# EAGLE design nano_bt_hor (EAGLE 9.5.0)
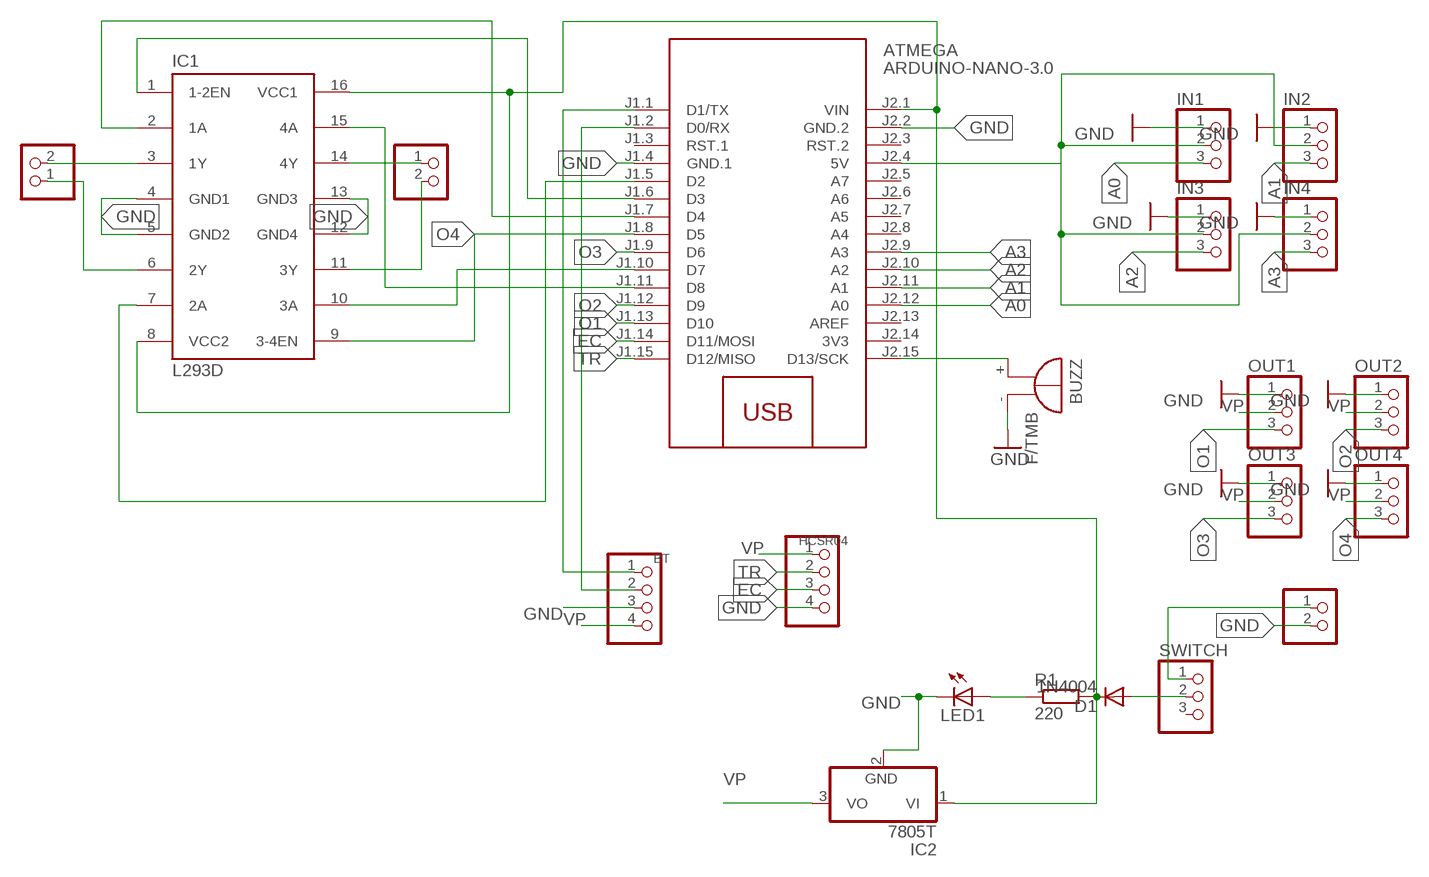
[diagram p0: schematic, sheet 1]

## Parts
ATMEGA  ARDUINO-NANO-3.0  [ARDUINO-NANO-3.0]
BT  PINHD-1X4  [1X04]
BUZZ  F/TMB  [F/TMB]
D1  1N4004  [DO41-10]
DCV  PINHD-1X2  [1X02]
HCSR04  PINHD-1X4  [1X04]
IC1  L293D  [DIL16]
IC2  7805T  [TO220H]
IN1  PINHD-1X3  [1X03]
IN2  PINHD-1X3  [1X03]
IN3  PINHD-1X3  [1X03]
IN4  PINHD-1X3  [1X03]
LED1  LED3MM  [LED3MM]
MT1  PINHD-1X2  [1X02]
MT2  PINHD-1X2  [1X02]
OUT1  PINHD-1X3  [1X03]
OUT2  PINHD-1X3  [1X03]
OUT3  PINHD-1X3  [1X03]
OUT4  PINHD-1X3  [1X03]
R1  220  R-EU_0204/7  [0204/7]
SWITCH  PINHD-1X3  [1X03]

## Nets
A0: ATMEGA.J2.12(A0) IN1.3
A1: ATMEGA.J2.11(A1) IN2.3
A2: ATMEGA.J2.10(A2) IN3.3
A3: ATMEGA.J2.9(A3) IN4.3
EC: ATMEGA.J1.14(D11/MOSI) HCSR04.3
GND: ATMEGA.J1.4(GND.1) ATMEGA.J2.2(GND.2) BT.3 BUZZ.- DCV.2 HCSR04.4 IC1.4(GND1) IC1.5(GND2) IC1.12(GND4) IC1.13(GND3) IC2.2(GND) IN1.1 IN2.1 IN3.1 IN4.1 LED1.K(C) OUT1.1 OUT2.1 OUT3.1 OUT4.1
N$1: IC1.3(1Y) MT1.2
N$2: IC1.6(2Y) MT1.1
N$3: IC1.14(4Y) MT2.1
N$4: IC1.11(3Y) MT2.2
N$5: ATMEGA.J1.1(D1/TX) BT.1
N$6: ATMEGA.J1.2(D0/RX) BT.2
N$7: ATMEGA.J2.15(D13/SCK) BUZZ.+
N$8: ATMEGA.J2.1(VIN) D1.C IC1.8(VCC2) IC1.16(VCC1) IC2.1(VI) R1.2
N$9: ATMEGA.J1.5(D2) IC1.7(2A)
N$10: ATMEGA.J1.6(D3) IC1.1(1-2EN)
N$11: ATMEGA.J1.7(D4) IC1.2(1A)
N$12: DCV.1 SWITCH.1
N$13: ATMEGA.J1.10(D7) IC1.10(3A)
N$14: ATMEGA.J1.11(D8) IC1.15(4A)
N$15: D1.A SWITCH.2
N$16: LED1.A R1.1
N$22: ATMEGA.J2.4(5V) IN1.2 IN2.2 IN3.2 IN4.2
O1: ATMEGA.J1.13(D10) OUT1.3
O2: ATMEGA.J1.12(D9) OUT2.3
O3: ATMEGA.J1.9(D6) OUT3.3
O4: ATMEGA.J1.8(D5) IC1.9(3-4EN) OUT4.3
TR: ATMEGA.J1.15(D12/MISO) HCSR04.2
VP: BT.4 HCSR04.1 IC2.3(VO) OUT1.2 OUT2.2 OUT3.2 OUT4.2
Unconnected: ATMEGA.J1.3(RST.1) ATMEGA.J2.3(RST.2) ATMEGA.J2.5(A7) ATMEGA.J2.6(A6) ATMEGA.J2.7(A5) ATMEGA.J2.8(A4) ATMEGA.J2.13(AREF) SWITCH.3

## Power pins joined to a net without a drawn wire
3V3: ATMEGA.J2.14(3V3)

## Library data of the parts
ATMEGA = diy-modules:ARDUINO-NANO-3.0: Arduino Nano 3.0 and compatible devices More details available here: https://www.arduino.cc/en/Main/ArduinoBoardNano Click here to find device on ebay.com <http://www.ebay.com/sch/arduino+nano>
BT HCSR04 = pinhead:PINHD-1X4: PIN HEADER
BUZZ = buzzer:F/TMB: BUZZER Source: Buerklin; OC_FARNELL: unknown; OC_NEWARK: unknown
D1 = adafruit_arduino:1N4004: DIODE General purpose 1N400x type rectifier (With bigger pads) http://www.ladyada.net/library/pcb/eaglelibrary.html
DCV MT1 MT2 = pinhead:PINHD-1X2: PIN HEADER
IC1 = st-microelectronics:L293D: PUSH-PULL 4 CHANNEL DRIVER; MPN: L293D; OC_FARNELL: 9589619; OC_NEWARK: 56P8249
IC2 = adafruit_arduino:78*: Positive VOLTAGE REGULATOR Added bigger pads to the TO-92 package
IN1-IN4 OUT1-OUT4 = adafruit:PINHD-1X3: PIN HEADER
LED1 = adafruit_arduino:LED: LED OSRAM: - CHIPLED LG R971, LG N971, LY N971, LG Q971, LY Q971, LO R971, LY R971 LH N974, LH R974 LS Q976, LO Q976, LY Q976 LO Q996 - Hyper CHIPLED LW Q18S LB Q993, LB Q99A, LB R99A - SideLED LS A670, LO A670, LY A670, LG A670, LP A670 LB A673, LV A673, LT A673, LW A673 LH A674 LY A675 LS A676, LA A676, LO A676, LY A676, LW A676 LS A679, LY A679, LG A679 - Hyper Micro SIDELED® LS Y876, LA Y876, LO Y876, LY Y876 LT Y87S - SmartLED LW L88C, LW L88S LB L89C, LB L89S, LG L890 LS L89K, LO L89K, LY L89K LS L896, LA L896, LO L896, LY L896 - TOPLED LS T670, LO T670, LY T670, LG T670, LP T670 LSG T670, LSP T670, LSY T670, LOP T670, LYG T670 LG T671, LOG T671, LSG T671 LB T673, LV T673, LT T673, LW T673 LH T674 LS T676, LA T676, LO T676, LY T676, LB T676, LH T676, LSB T676, LW T676 LB T67C, LV T67C, LT T67C, LS T67K, LO T67K, LY T67K, LW E67C LS E67B, LA E67B, LO E67B, LY E67B, LB E67C, LV E67C, LT E67C LW T67C LS T679, LY T679, LG T679 LS T770, LO T770, LY T770, LG T770, LP T770 LB T773, LV T773, LT T773, LW T773 LH T774 LS E675, LA E675, LY E675, LS T675 LS T776, LA T776, LO T776, LY T776, LB T776 LHGB T686 LT T68C, LB T68C - Hyper Mini TOPLED® LB M676 - Mini TOPLED Santana® LG M470 LS M47K, LO M47K, LY M47K Source: http://www.osram.convergy.de/
R1 = rcl:R-EU_: RESISTOR, European symbol; SPICEPREFIX: R
SWITCH = adafruit_arduino:PINHD-1X3: PIN HEADER

## Board
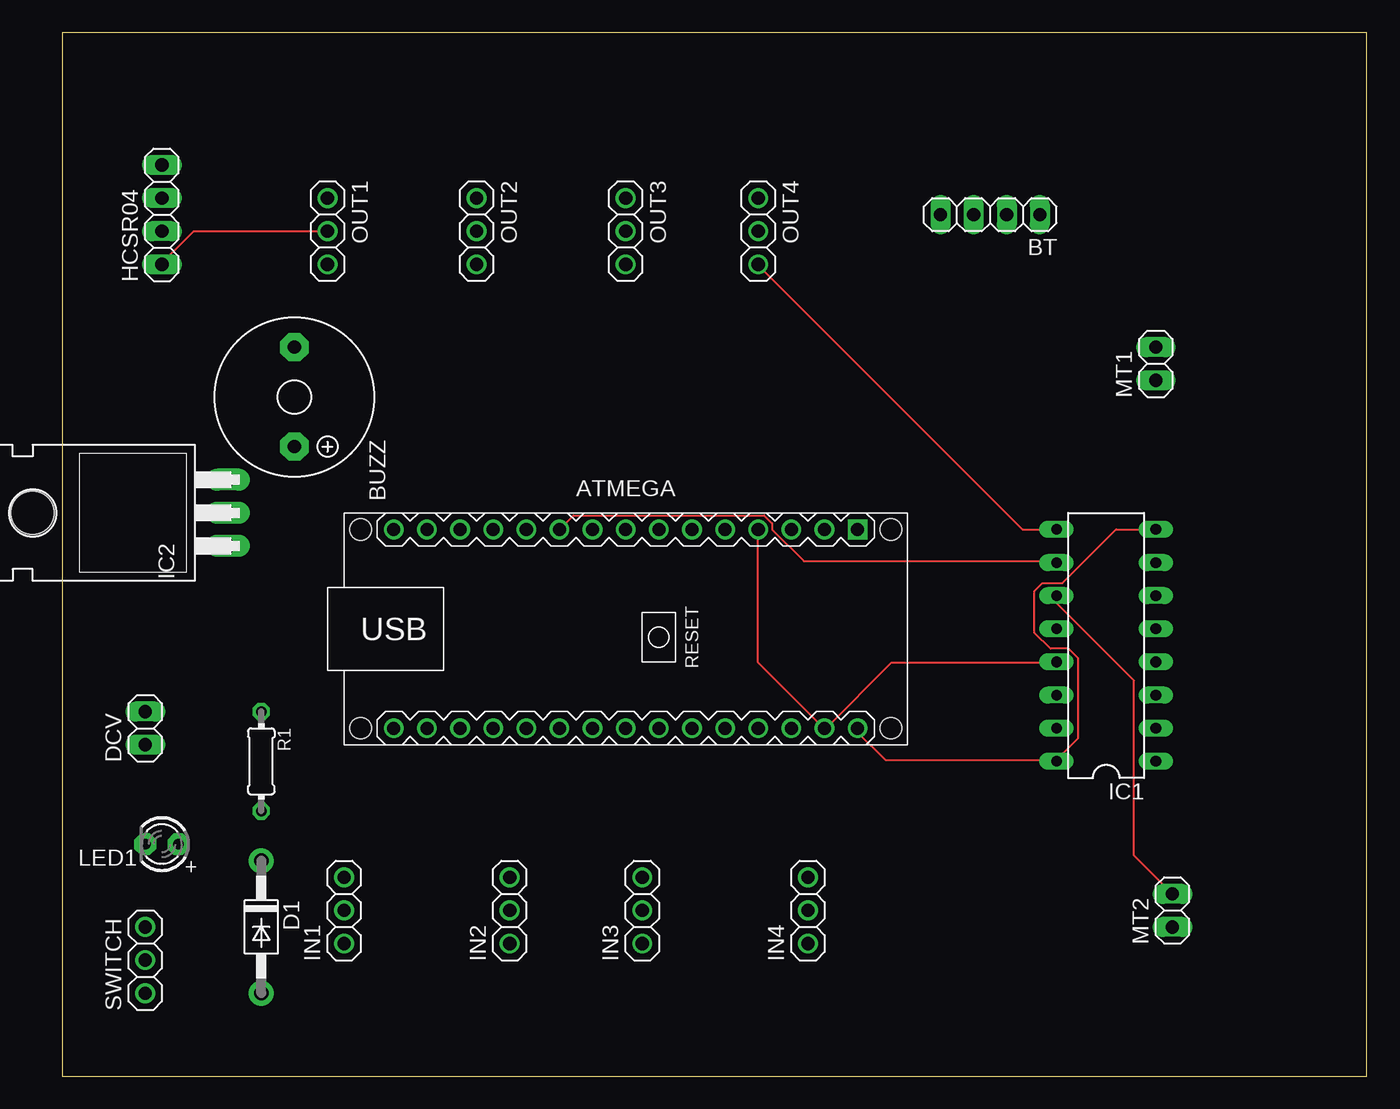
[diagram p1: board, top side]
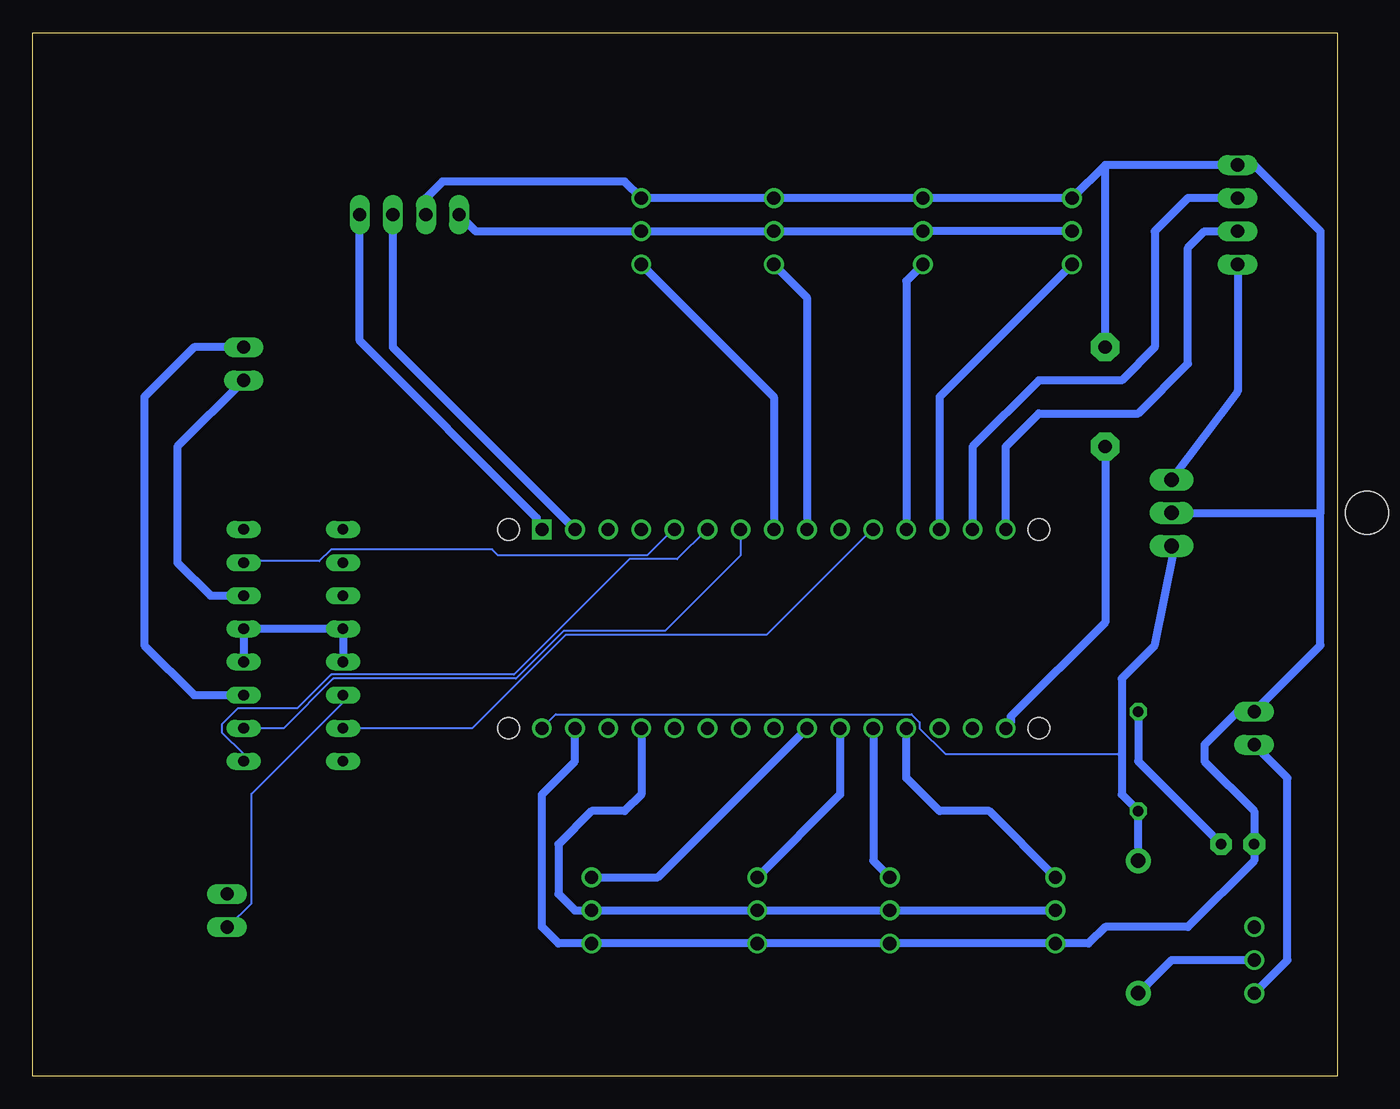
[diagram p2: board, bottom side, seen from below]

Size 100 x 80 mm. Coordinates in mm from the lower left corner, seen from the top.
Outline: 0,0 100,0 100,80 0,80 0,0
Copper layers (1*16): Top 0.035mm / dielectric 1.5mm / Bottom 0.035mm
Design rules "default": minimum track width 6mil, minimum drill 0.35mm, track to track 6mil, track to pad 6mil, pad to pad 6mil, via to via 6mil, smd to smd 6mil, copper to edge 40mil, drill to drill 6mil, minimum pad ring 10mil, minimum via ring 8mil, stop-mask expansion 4mil, vias tented up to drill 0mil, thermal gap 10mil

### Footprints (pad centres in the part's own frame; a part is rotated, then mirrored left to right if it is on the bottom)
ARDUINO-NANO-3.0 = drill 1 square: J1.1 17.78,7.62 | drill 1: J1.2 15.24,7.62; J1.3 12.7,7.62; J1.4 10.16,7.62; J1.5 7.62,7.62; J1.6 5.08,7.62; J1.7 2.54,7.62; J1.8 0,7.62; J1.9 -2.54,7.62; J1.10 -5.08,7.62; J1.11 -7.62,7.62; J1.12 -10.16,7.62; J1.13 -12.7,7.62; J1.14 -15.24,7.62; J1.15 -17.78,7.62; J2.1 17.78,-7.62; J2.2 15.24,-7.62; J2.3 12.7,-7.62; J2.4 10.16,-7.62; J2.5 7.62,-7.62; J2.6 5.08,-7.62; J2.7 2.54,-7.62; J2.8 0,-7.62; J2.9 -2.54,-7.62; J2.10 -5.08,-7.62; J2.11 -7.62,-7.62; J2.12 -10.16,-7.62; J2.13 -12.7,-7.62; J2.14 -15.24,-7.62; J2.15 -17.78,-7.62 | hole 1.651: -20.32,7.62; -20.32,-7.62; 20.32,-7.62; 20.32,7.62
1X04 = drill 1.016 long: 1 -3.81,0; 2 -1.27,0; 3 1.27,0; 4 3.81,0
F/TMB = drill 1.016 pad 2.159 octagon: + 3.81,0; - -3.81,0
DO41-10 = drill 1.118 pad 1.93: A 5.08,0; C -5.08,0
1X02 = drill 1.016 long: 1 -1.27,0; 2 1.27,0
DIL16 = drill 0.813 long: 1 -8.89,-3.81; 2 -6.35,-3.81; 3 -3.81,-3.81; 4 -1.27,-3.81; 5 1.27,-3.81; 6 3.81,-3.81; 7 6.35,-3.81; 8 8.89,-3.81; 9 8.89,3.81; 10 6.35,3.81; 11 3.81,3.81; 12 1.27,3.81; 13 -1.27,3.81; 14 -3.81,3.81; 15 -6.35,3.81; 16 -8.89,3.81
TO220H = drill 1.118 long: 1 -2.54,-10.16; 2 0,-10.16; 3 2.54,-10.16 | hole 3.302: 0,4.826
1X03 = drill 1.016: 1 -2.54,0; 2 0,0; 3 2.54,0
LED3MM = drill 0.813 pad 1.676 octagon: A -1.27,0; K 1.27,0
0204/7 = drill 0.813 octagon: 1 -3.81,0; 2 3.81,0

### Placement (x,y rotation side)
ATMEGA  43.18,34.29 0 top
BT  71.12,66.04 180 top
BUZZ  17.78,52.07 270 top
D1  15.24,11.43 270 top
DCV  6.35,26.67 90 top
HCSR04  7.62,66.04 90 top
IC1  80.01,33.02 90 top
IC2  2.54,43.18 90 top
IN1  21.59,12.7 90 top
IN2  34.29,12.7 90 top
IN3  44.45,12.7 90 top
IN4  57.15,12.7 90 top
LED1  7.62,17.78 180 top
MT1  83.82,54.61 90 top
MT2  85.09,12.7 90 top
OUT1  20.32,64.77 270 top
OUT2  31.75,64.77 270 top
OUT3  43.18,64.77 270 top
OUT4  53.34,64.77 270 top
R1  15.24,24.13 270 top
SWITCH  6.35,8.89 90 top

### Tracks (layer width: path | path; a pad name or v marks a point on that pad's centre or on a via)
A0
  Bottom 0.61: IN1.3 26.67,20.32 30.48,20.32 33.02,22.86 ATMEGA.J2.12
A1
  Bottom 0.61: ATMEGA.J2.11 35.56,16.51 IN2.3
A2
  Bottom 0.61: ATMEGA.J2.10 38.1,21.59 IN3.3
A3
  Bottom 0.61: IN4.3 52.07,15.24 ATMEGA.J2.9
EC
  Bottom 0.61: HCSR04.3 11.43,67.31 13.97,64.77 13.97,55.88 16.51,53.34 22.86,53.34 27.94,48.26 ATMEGA.J1.14
GND
  Top 0.152: ATMEGA.J1.4 53.34,31.7 58.37,26.67 ATMEGA.J2.2 58.52,26.67 63.55,31.7 76.2,31.7 IC1.13
  Bottom 0.61: 1.27,43.18 1.27,33.02 DCV.2 7.62,27.94 10.16,25.4 10.16,24.13 6.35,20.32 LED1.K 6.35,16.51 11.43,11.43 17.78,11.43 19.05,10.16 IN1.1 IN2.1 IN3.1 IN4.1 59.69,10.16 60.96,11.43 60.96,21.59 58.42,24.13 ATMEGA.J2.2 | IC2.2 1.27,43.18 | 1.27,43.18 1.27,64.77 6.35,69.85 HCSR04.4 17.78,69.85 | 17.78,69.85 OUT1.1 OUT2.1 OUT3.1 OUT4.1 54.61,68.58 68.58,68.58 69.85,67.31 BT.3 | BUZZ.- 17.78,69.85 | IC1.4 IC1.5 IC1.12 IC1.13
N$1
  Bottom 0.61: MT1.2 87.63,55.88 91.44,52.07 91.44,33.02 87.63,29.21 IC1.3
N$2
  Bottom 0.61: MT1.1 88.9,48.26 88.9,39.37 86.36,36.83 IC1.6
N$3
  Bottom 0.152: IC1.14 76.2,28.65 83.21,21.64 83.21,13.26 85.04,11.43 MT2.1
N$4
  Top 0.152: IC1.11 76.2,36.27 82.14,30.33 82.14,16.92 MT2.2
N$5
  Bottom 0.61: ATMEGA.J1.1 61.35,42.3 61.35,42.8 74.93,56.38 BT.1
N$6
  Bottom 0.61: BT.2 72.39,55.88 ATMEGA.J1.2
N$7
  Bottom 0.61: ATMEGA.J2.15 25.01,27.06 25.01,27.56 17.78,34.78 BUZZ.+
N$8
  Top 0.152: 76.2,24.23 63.09,24.23 60.96,26.36 ATMEGA.J2.1 | IC1.8 80.77,41.91 76.66,37.8 75.13,37.8 74.52,37.19 74.52,33.98 75.74,32.77 77.11,32.77 77.88,32 77.88,25.91 76.2,24.23 | 76.2,24.23 IC1.16
  Bottom 0.152: 16.51,24.69 30.02,24.69 32,26.67 32,27.13 32.61,27.74 59.89,27.74 ATMEGA.J2.1
  Bottom 0.61: D1.C R1.2 16.51,21.59 16.51,24.69 16.51,30.48 13.97,33.02 12.53,40.23 IC2.1
N$9
  Bottom 0.152: IC1.7 83.82,39.47 78.03,39.47 77.11,40.39 64.77,40.39 64.31,39.93 52.88,39.93 50.9,41.91 ATMEGA.J1.5
N$10
  Bottom 0.152: IC1.1 83.82,24.69 85.5,26.36 85.5,26.98 84.28,28.19 79.7,28.19 77.11,30.79 63.09,30.79 54.25,39.62 50.6,39.62 48.31,41.91 ATMEGA.J1.6
N$11
  Bottom 0.152: IC1.2 80.77,26.67 76.96,30.48 62.94,30.48 59.28,34.14 51.51,34.14 45.72,39.93 ATMEGA.J1.7
N$12
  Bottom 0.61: SWITCH.1 3.81,8.89 3.81,22.86 DCV.1
N$13
  Top 0.152: ATMEGA.J1.10 39.17,42.98 53.8,42.98 54.41,42.37 54.41,41.91 56.84,39.47 76.2,39.47 IC1.10
N$14
  Bottom 0.152: IC1.15 66.29,26.67 59.13,33.83 43.74,33.83 35.66,41.91 ATMEGA.J1.11
N$15
  Bottom 0.61: SWITCH.2 12.7,8.89 D1.A
N$16
  Bottom 0.61: R1.1 15.24,24.13 LED1.A
N$22
  Bottom 0.61: IN1.2 IN2.2 IN3.2 IN4.2 58.42,12.7 59.69,13.97 59.69,17.78 57.15,20.32 54.61,20.32 53.34,21.59 ATMEGA.J2.4
O1
  Bottom 0.61: OUT1.3 30.48,52.07 ATMEGA.J1.13
O2
  Bottom 0.61: OUT2.3 33.02,60.96 ATMEGA.J1.12
O3
  Bottom 0.61: OUT3.3 40.64,59.69 ATMEGA.J1.9
O4
  Top 0.152: IC1.9 73.61,41.91 53.34,62.18 OUT4.3
  Bottom 0.61: OUT4.3 43.18,52.07 ATMEGA.J1.8
TR
  Bottom 0.61: HCSR04.2 10.16,64.77 11.43,63.5 11.43,54.61 15.24,50.8 22.86,50.8 25.4,48.26 ATMEGA.J1.15
VP
  Top 0.152: OUT1.2 10.06,64.77 7.62,62.33 HCSR04.1
  Bottom 0.61: IC2.3 7.62,52.49 HCSR04.1 | OUT1.2 OUT2.2 OUT3.2 OUT4.2 66.04,64.77 BT.4